# EAGLE design TinyOne (EAGLE 7.7.0)
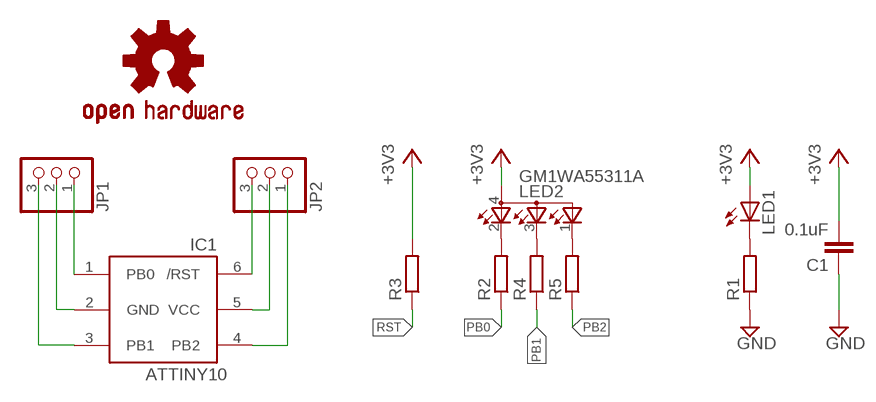
[diagram p0: schematic, sheet 1]

## Parts
C1  0.1uF  C-EUC0603  [C0603]
IC1  ATTINY10  [SOT23-6]
JP1  PINHD-1X3CB  [1X03-CLEANBIG]
JP2  PINHD-1X3CB  [1X03-CLEANBIG]
LED1  LEDCHIP-LED0603  [CHIP-LED0603]
LED2  GM1WA55311A  [GM1WA55311A]
R1  R-EU_R0603  [R0603]
R2  R-EU_R0603  [R0603]
R3  R-EU_R0603  [R0603]
R4  R-EU_R0603  [R0603]
R5  R-EU_R0603  [R0603]
U$1  OSHW-LOGOS  [OSHW-LOGO-S]

## Nets
+3V3: C1.2 IC1.5(VCC) JP2.2 LED1.A LED2.4(A) R3.2
GND: C1.1 IC1.2(GND) JP1.2 R1.1
N$1: LED2.2(CRED) R2.2
N$2: LED2.3(CBLUE) R4.2
N$3: LED2.1(CGREEN) R5.2
N$7: LED1.C R1.2
PB0: IC1.1(PB0) JP1.1 R2.1
PB1: IC1.3(PB1) JP1.3 R4.1
PB2: IC1.4(PB2) JP2.1 R5.1
RST: IC1.6(/RST) JP2.3 R3.1

## Library data of the parts
C1 = rcl:C-EU: CAPACITOR, European symbol
IC1 = adafruit:ATTINY10: ATtiny4/5/9/10 8-bit Microcontroller with 512/1024 Bytes In-System Programmable Flash
JP1 JP2 = adafruit:PINHD-1X3: PIN HEADER
LED1 = adafruit:LED: LED OSRAM: - CHIPLED LG R971, LG N971, LY N971, LG Q971, LY Q971, LO R971, LY R971 LH N974, LH R974 LS Q976, LO Q976, LY Q976 LO Q996 - Hyper CHIPLED LW Q18S LB Q993, LB Q99A, LB R99A - SideLED LS A670, LO A670, LY A670, LG A670, LP A670 LB A673, LV A673, LT A673, LW A673 LH A674 LY A675 LS A676, LA A676, LO A676, LY A676, LW A676 LS A679, LY A679, LG A679 - Hyper Micro SIDELED� LS Y876, LA Y876, LO Y876, LY Y876 LT Y87S - SmartLED LW L88C, LW L88S LB L89C, LB L89S, LG L890 LS L89K, LO L89K, LY L89K LS L896, LA L896, LO L896, LY L896 - TOPLED LS T670, LO T670, LY T670, LG T670, LP T670 LSG T670, LSP T670, LSY T670, LOP T670, LYG T670 LG T671, LOG T671, LSG T671 LB T673, LV T673, LT T673, LW T673 LH T674 LS T676, LA T676, LO T676, LY T676, LB T676, LH T676, LSB T676, LW T676 LB T67C, LV T67C, LT T67C, LS T67K, LO T67K, LY T67K, LW E67C LS E67B, LA E67B, LO E67B, LY E67B, LB E67C, LV E67C, LT E67C LW T67C LS T679, LY T679, LG T679 LS T770, LO T770, LY T770, LG T770, LP T770 LB T773, LV T773, LT T773, LW T773 LH T774 LS E675, LA E675, LY E675, LS T675 LS T776, LA T776, LO T776, LY T776, LB T776 LHGB T686 LT T68C, LB T68C - Hyper Mini TOPLED� LB M676 - Mini TOPLED Santana� LG M470 LS M47K, LO M47K, LY M47K Source: http://www.osram.convergy.de/
LED2 = led:GM1WA55311A: Chip LED RGB Source: http://document.sharpsma.com/files/GM1WA55311A_SS.pdf
R1-R5 = rcl:R-EU_: RESISTOR, European symbol
U$1 = SparkFun:OSHW-LOGO: Open Source Hardware Logo This logo indicates the piece of hardware it is found on incorporates a OSHW license and/or adheres to the definition of open source hardware found here: http://freedomdefined.org/OSHW

## Board
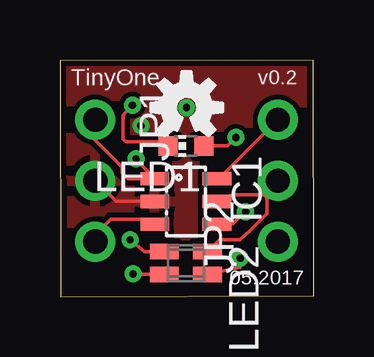
[diagram p1: board, top side]
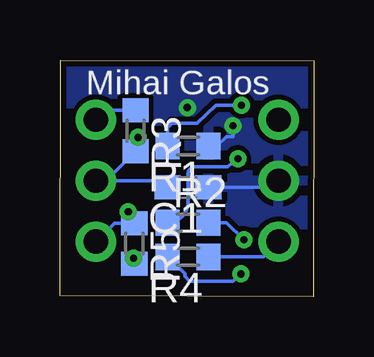
[diagram p2: board, bottom side, seen from below]

Size 10.6 x 9.86 mm. Coordinates in mm from the lower left corner, seen from the top.
Outline: 0.03,0 10.6,0.03 10.57,9.86 0,9.83 0.03,0
Copper layers (1*16): Top 0.035mm / dielectric 1.5mm / Bottom 0.035mm
Design rules "default *": minimum track width 6mil, minimum drill 0.3mm, track to track 8mil, track to pad 8mil, pad to pad 8mil, via to via 8mil, smd to smd 8mil, copper to edge 10mil, drill to drill 8mil, minimum pad ring 10mil, minimum via ring 8mil, stop-mask expansion 4mil, vias tented up to drill 0mil, thermal gap 10mil

### Footprints (pad centres in the part's own frame; a part is rotated, then mirrored left to right if it is on the bottom)
C0603 = smd 1.1 x 1: 1 -0.85,0; 2 0.85,0
SOT23-6 = smd 0.55 x 1.2: 1 -0.95,-1.3; 2 0,-1.3; 3 0.95,-1.3; 4 0.95,1.3; 5 0,1.3; 6 -0.95,1.3
1X03-CLEANBIG = drill 1.016 pad 1.676: 1 -2.54,0; 2 0,0; 3 2.54,0
CHIP-LED0603 = smd 0.8 x 0.8: A 0,-0.75; C 0,0.75
GM1WA55311A = smd 0.65 x 1.2: 1 0.477,0.9; 2 -0.475,-0.9; 3 0.475,-0.9; 4 -0.477,0.9
R0603 = smd 1 x 1.1: 1 -0.85,0; 2 0.85,0

### Placement (x,y rotation side)
C1  5.26,4.55 180 bottom
IC1  5.26,3.96 270 top
JP1  1.47,4.83 270 top
JP2  9.09,4.83 90 top
LED1  5.26,6.27 90 top
LED2  5.26,1.4 270 top
R1  5.26,6.27 180 bottom
R2  5.26,3.07 0 bottom
R3  7.44,6.91 270 bottom
R4  5.26,1.65 180 bottom
R5  7.49,2.21 270 bottom
U$1  5.28,7.87 0 top

### Tracks (layer width: path | path; a pad name or v marks a point on that pad's centre or on a via)
+3V3  (via drill 0.3)
  Top 0.152: LED1.A 6.99,6.27 v7.34,6.63 | IC1.5 7.19,4.24 8.51,4.24 | 8.51,4.24 JP2.2 | LED2.4 6.66,2.37 7.52,2.36 7.95,2.77 8.64,3.45 8.64,4.12 8.51,4.24
  Bottom 0.152: v7.34,6.63 7.34,6.16 R3.2 8.68,4.83 JP2.2 6.41,4.83 arc90 C1.2
GND  (via drill 0.3)
  Top 0.152: IC1.2 2.34,3.96 JP1.2
  Bottom 0.152: C1.1 1.75,4.55 JP1.2 | R1.1 4.04,6.27 3.66,6.66 3.38,6.66 v3.38,7.11
  other vias: 5.28,7.87
  pour Top: 0.18,0.05 10.34,0.05 10.36,9.91 0.2,9.91
  pour Bottom: 0.15,0.03 10.31,0.03 10.36,9.91 0.2,9.91
N$1  (via drill 0.3)
  Top 0.152: v2.92,2.36 3.54,1.87 LED2.2
  Bottom 0.152: R2.2 3.66,3.07 v2.92,2.36
N$2  (via drill 0.3)
  Top 0.152: LED2.3 3.07,0.92 v3.05,0.94
  Bottom 0.152: v3.05,0.94 3.07,0.94 3.38,0.64 5.18,0.64 5.39,0.84 5.39,0.95 R4.2
N$3  (via drill 0.3)
  Top 0.152: LED2.1 7.51,1.21 v7.52,1.6
  Bottom 0.152: v7.52,1.6 7.21,1.64 R5.2
N$7  (via drill 0.3)
  Top 0.152: LED1.C 4.14,6.45 2.77,6.45 2.64,6.55 2.64,7.54 2.9,7.85 v3.02,7.98
  Bottom 0.152: v3.02,7.98 4.09,7.98 4.88,7.21 5.92,7.21 6.11,7.02 R1.2
PB0  (via drill 0.3)
  Top 0.152: JP1.1 1.47,6.5 2.59,5.38 2.59,5.16 2.85,4.9 4,4.9 IC1.1 3.21,5.69 v3.18,5.74
  Bottom 0.152: v3.18,5.74 3.61,5.41 4.98,5.41 arc-90 5.26,5 5.26,3.9 arc90 R2.1
PB1
  Top 0.152: JP1.3 1.47,2.59 2.11,3.23 3.43,3.23 IC1.3
  Bottom 0.152: R4.1 2.11,1.65 JP1.3
PB2  (via drill 0.3)
  Top 0.152: v7.75,3.53 7.62,3.43 7.21,3.02 6.62,3.02 IC1.4
  Bottom 0.152: JP2.1 8.32,3.06 R5.1 7.49,3.15 v7.75,3.53
RST
  Top 0.152: IC1.6 6.64,4.91 JP2.3
  Bottom 0.152: R3.1 8.7,7.76 JP2.3

### Text on the board
tPlace: TinyOne | v0.2 | 05.2017
bPlace: Mihai Galos